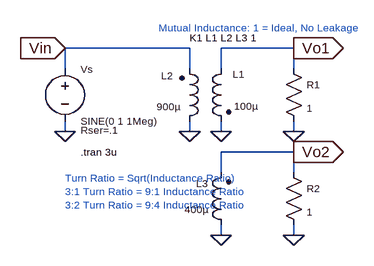
[diagram p0: schematic Transformer-3coil.asc]
Transformer-3coil.asc, the LTspice schematic file:
Version 4
SHEET 1 880 680
WIRE 160 -48 -32 -48
WIRE 320 -48 208 -48
WIRE -32 -16 -32 -48
WIRE 160 -16 160 -48
WIRE 208 -16 208 -48
WIRE 320 -16 320 -48
WIRE -32 80 -32 64
WIRE 160 80 160 64
WIRE 208 80 208 64
WIRE 320 80 320 64
WIRE 320 112 208 112
WIRE 208 144 208 112
WIRE 320 144 320 112
WIRE 208 240 208 224
WIRE 320 240 320 224
FLAG -32 80 0
FLAG 160 80 0
FLAG 208 80 0
FLAG 320 80 0
FLAG 320 -48 Vo1
IOPIN 320 -48 Out
FLAG -32 -48 Vin
IOPIN -32 -48 In
FLAG 208 240 0
FLAG 320 240 0
FLAG 320 112 Vo2
IOPIN 320 112 Out
SYMBOL voltage -32 -32 R0
WINDOW 123 0 0 Left 0
WINDOW 39 24 110 Left 1
WINDOW 0 24 16 Left 1
WINDOW 3 24 96 Left 1
SYMATTR SpiceLine Rser=.1
SYMATTR InstName Vs
SYMATTR Value SINE(0 1 1Meg)
SYMBOL res 304 -32 R0
WINDOW 0 36 40 Left 1
WINDOW 3 36 76 Left 1
SYMATTR InstName R1
SYMATTR Value 1
SYMBOL ind2 144 80 M180
WINDOW 0 82 88 Left 1
WINDOW 3 84 39 Left 1
SYMATTR InstName L1
SYMATTR Value 100µ
SYMATTR Type ind
SYMBOL ind2 224 -32 M0
WINDOW 0 90 26 Left 1
WINDOW 3 79 74 Left 1
SYMATTR InstName L2
SYMATTR Value 900µ
SYMATTR Type ind
SYMBOL res 304 128 R0
WINDOW 0 36 40 Left 1
WINDOW 3 36 76 Left 1
SYMATTR InstName R2
SYMATTR Value 1
SYMBOL ind2 224 240 R180
WINDOW 0 36 80 Left 1
WINDOW 3 36 40 Left 1
SYMATTR InstName L3
SYMATTR Value 400µ
SYMATTR Type ind
TEXT 112 -80 Left 1 ;Mutual Inductance: 1 = Ideal, No Leakage
TEXT -8 112 Left 1 !.tran 3u
TEXT 160 -64 Left 1 !K1 L1 L2 L3 1
TEXT -32 152 Left 1 ;Turn Ratio = Sqrt(Inductance Ratio)\n3:1 Turn Ratio = 9:1 Inductance Ratio\n3:2 Turn Ratio = 9:4 Inductance Ratio

The netlist it stands for:
* Transformer-3coil.asc
Vs Vin 0 SINE(0 1 1Meg) Rser=.1
R1 Vo1 0 1
L1 0 Vin 100µ
L2 Vo1 0 900µ
R2 Vo2 0 1
L3 0 Vo2 400µ
* Mutual Inductance: 1 = Ideal, No Leakage
.tran 3u
K1 L1 L2 L3 1
* Turn Ratio = Sqrt(Inductance Ratio)
* 3:1 Turn Ratio = 9:1 Inductance Ratio
* 3:2 Turn Ratio = 9:4 Inductance Ratio
.backanno
.end